# EAGLE design eh (EAGLE 6.4)
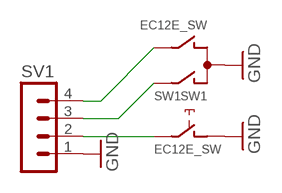
[diagram p0: schematic, sheet 1]

## Parts
SV1  MA04-1  [MA04-1]
SW1  EC12E_SW  [ALPS_EC12E_SW]

## Nets
GND: SV1.1 SW1.C SW1.D
N$1: SV1.4 SW1.B
N$2: SV1.3 SW1.A
N$3: SV1.2 SW1.E
Unconnected: SW1.GND1(G) SW1.GND2(G)

## Library data of the parts
SV1 = con-lstb:MA04-1: PIN HEADER; OC_FARNELL: unknown; OC_NEWARK: unknown
SW1 = switch-alps:EC12E_SW: ALPS rotary Encoder EC12E series with switch; MPN: EC12E2424407; OC_FARNELL: 1520813; OC_NEWARK: 74M1068

## Board
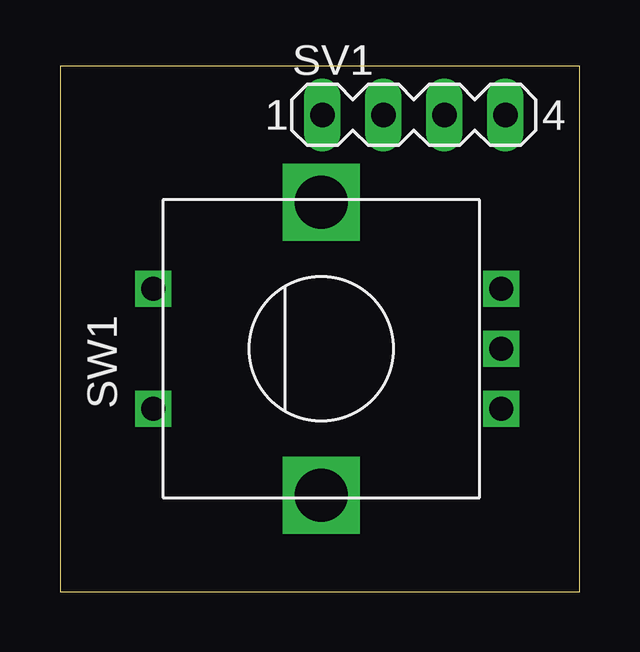
[diagram p1: board, top side]
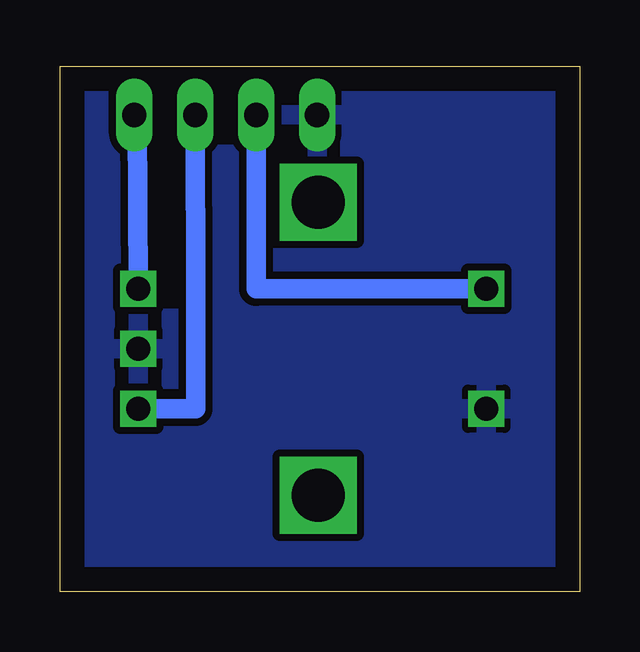
[diagram p2: board, bottom side, seen from below]

Size 21.65 x 21.9 mm. Coordinates in mm from the lower left corner, seen from the top.
Outline: 0,0 21.65,0 21.65,21.9 0,21.9 0,0
Copper layers (1*16): Top 0.035mm / dielectric 1.5mm / Bottom 0.035mm
Design rules "default": minimum track width 10mil, minimum drill 24mil, track to track 8mil, track to pad 8mil, pad to pad 8mil, via to via 8mil, smd to smd 8mil, copper to edge 40mil, drill to drill 8mil, minimum pad ring 10mil, minimum via ring 8mil, stop-mask expansion 4mil, vias tented up to drill 0mil, thermal gap 10mil

### Footprints (pad centres in the part's own frame; a part is rotated, then mirrored left to right if it is on the bottom)
MA04-1 = drill 1.016 long: 1 -3.81,0; 2 -1.27,0; 3 1.27,0; 4 3.81,0
ALPS_EC12E_SW = drill 1 square: A -2.5,-7.5; B 2.5,-7.5; C 0,-7.5; D -2.5,7; E 2.5,7 | drill 2.2 square: GND1 -6.1,0; GND2 6.1,0

### Placement (x,y rotation side)
SV1  14.75,19.87 0 top
SW1  10.89,10.13 90 top

### Tracks (layer width: path | path; a pad name or v marks a point on that pad's centre or on a via)
GND
  pour Bottom (isolate 0.305): 0.64,23.24 23.24,23.24 23.24,-0.76 0.64,-0.76
N$1
  Bottom 0.813: SW1.B 18.43,19.74 SV1.4
N$2
  Bottom 0.813: SW1.A 16,7.63 16,15.88 16.02,16 SV1.3
N$3
  Bottom 0.813: SW1.E 13.48,12.63 SV1.2